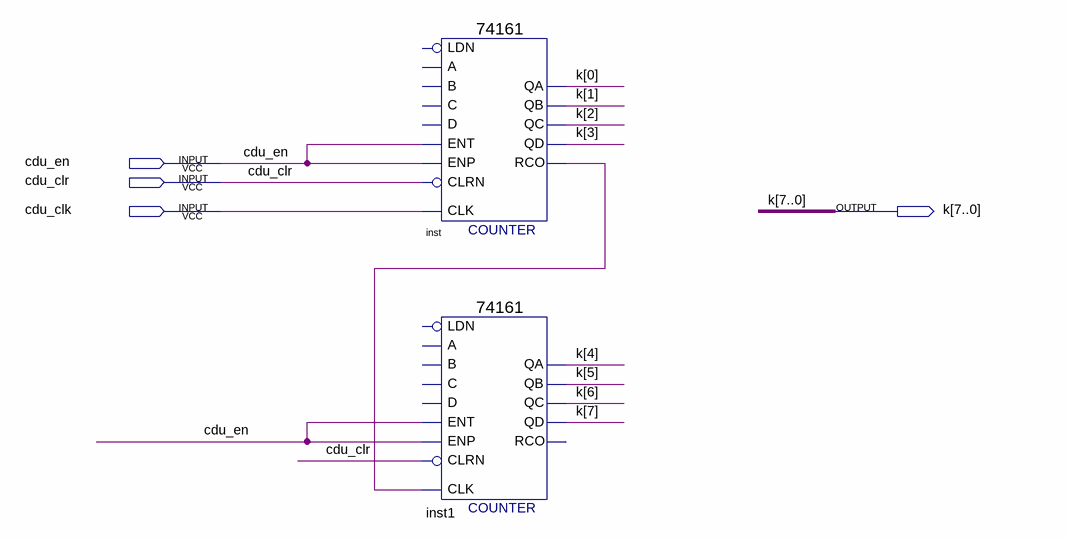
[diagram p0: schematic sheet]
// Quartus schematic getData.bdf as structural Verilog: 2 symbols, 4 pins
module getData (
  input  cdu_en,
  input  cdu_clr,
  input  cdu_clk,
  output [7:0] k
);

  wire inst_rco;

  \74161  inst (
    .CLRN(cdu_clr), .CLK(cdu_clk), .ENP(cdu_en), .ENT(cdu_en), .QD(k[3]), .QC(k[2]), .QB(k[1]), .QA(k[0]),
    .RCO(inst_rco));  // open: LDN, A, D, B, C
  \74161  inst1 (
    .CLRN(cdu_clr), .CLK(inst_rco), .ENP(cdu_en), .ENT(cdu_en), .QD(k[7]), .QC(k[6]), .QB(k[5]), .QA(k[4]));  // open: LDN, A, D, B, C, RCO
endmodule
